# EAGLE schematic eagel_108 (EAGLE 7.7.0)
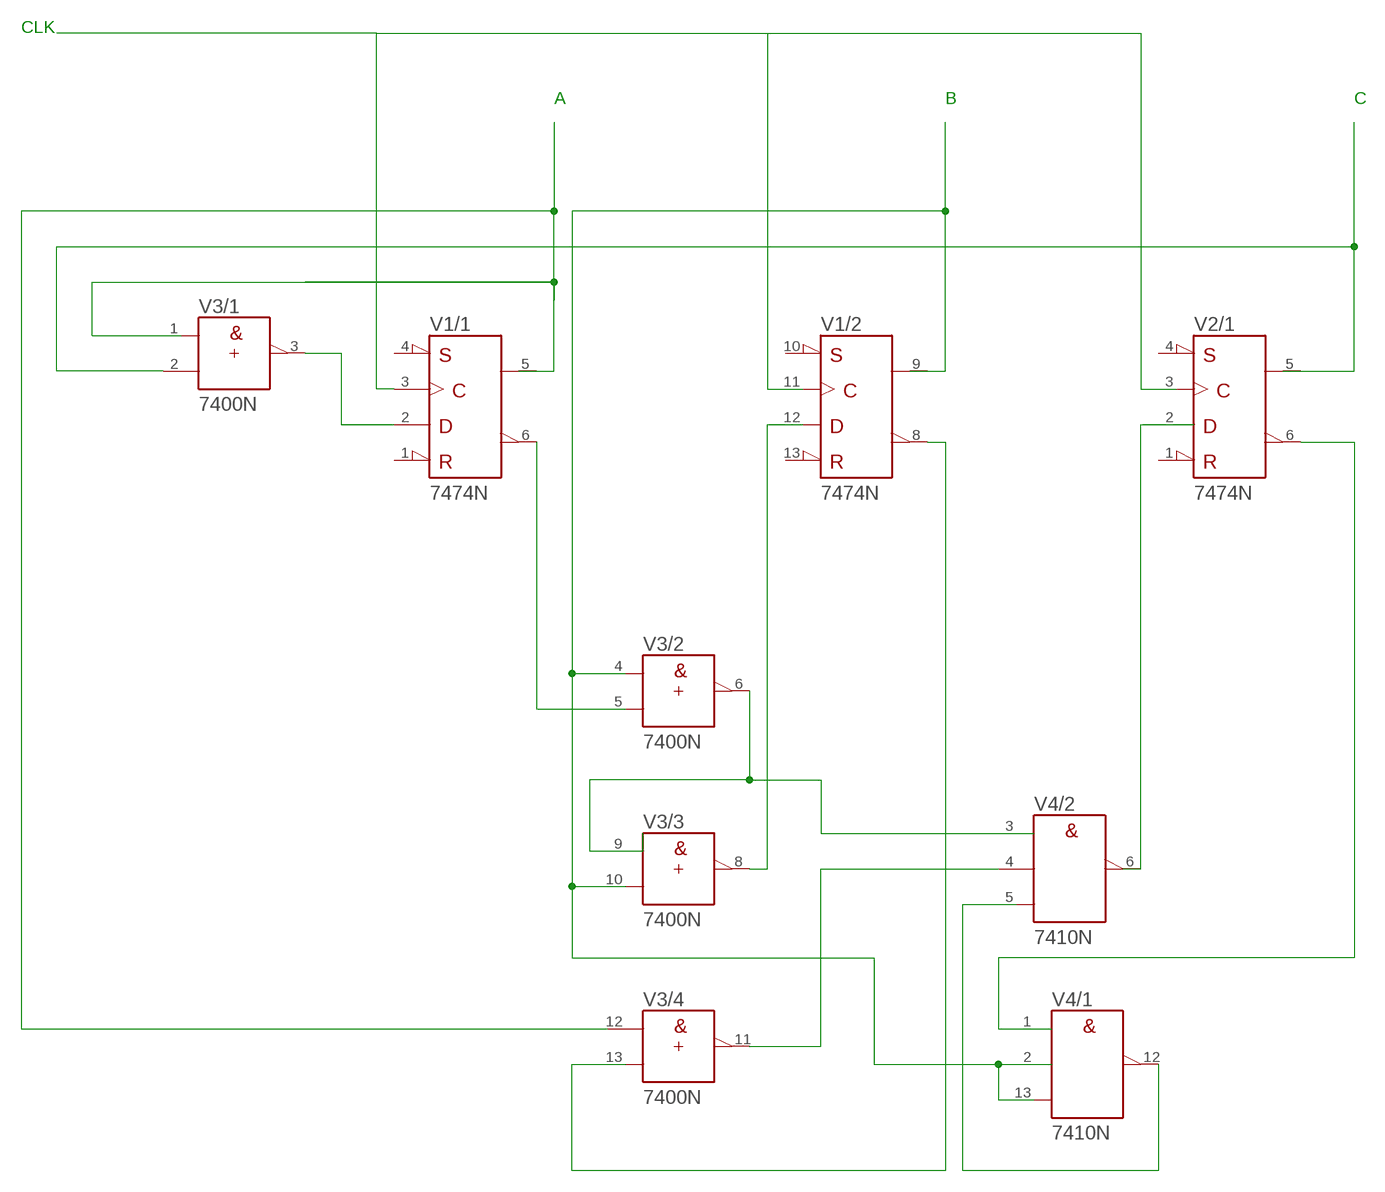
[diagram p0: schematic, sheet 1]

## Parts
V1  7474N  [DIL14]
V2  7474N  [DIL14]
V3  7400N  [DIL14]
V4  7410N  [DIL14]

## Nets
N$1: V3.12(/4:A)
N$3: V1.2(/1:D) V3.3(/1:Y)
N$4: V3.1(/1:A)
N$5: V3.2(/1:B)
N$6: V1.6(/1:!Q)
N$7: V2.6(/1:!Q)
N$8: V1.8(/2:!Q)
N$9: V3.6(/2:Y)
N$10: V3.8(/3:Y)
N$11: V3.11(/4:Y)
N$12: V4.12(/1:Y)
N$14: V1.3(/1:CLK)
Unconnected: V1.1(/1:!CLR) V1.4(/1:!PRE) V1.5(/1:Q) V1.9(/2:Q) V1.10(/2:!PRE) V1.11(/2:CLK) V1.12(/2:D) V1.13(/2:!CLR) V2.1(/1:!CLR) V2.2(/1:D) V2.3(/1:CLK) V2.4(/1:!PRE) V2.5(/1:Q) V2.8(/2:!Q) V2.9(/2:Q) V2.10(/2:!PRE) V2.11(/2:CLK) V2.12(/2:D) V2.13(/2:!CLR) V3.4(/2:A) V3.5(/2:B) V3.9(/3:A) V3.10(/3:B) V3.13(/4:B) V4.1(/1:A) V4.2(/1:B) V4.3(/2:A) V4.4(/2:B) V4.5(/2:C) V4.6(/2:Y) V4.8(/3:Y) V4.9(/3:A) V4.10(/3:B) V4.11(/3:C) V4.13(/1:C)

## Notes on the sheet
- CLK
- A | B | C

## Power pins joined to a net without a drawn wire
+UB: V1.14(/+UB:+UB) V2.14(/+UB:+UB) V3.14(/+UB:+UB) V4.14(/+UB:+UB)
-UB: V1.7(/-UB:-UB) V2.7(/-UB:-UB) V3.7(/-UB:-UB) V4.7(/-UB:-UB)

## Library data of the parts
V1 V2 = 74ttl-din:74*74: Dual D type positive edge triggered FLIP FLOP, preset and clear
V3 = 74ttl-din:74*00: Quad 2-input NAND gate
V4 = 74ttl-din:74*10: Triple 3-input NAND gate